# Altium schematic sheet 007.SchDoc
size A
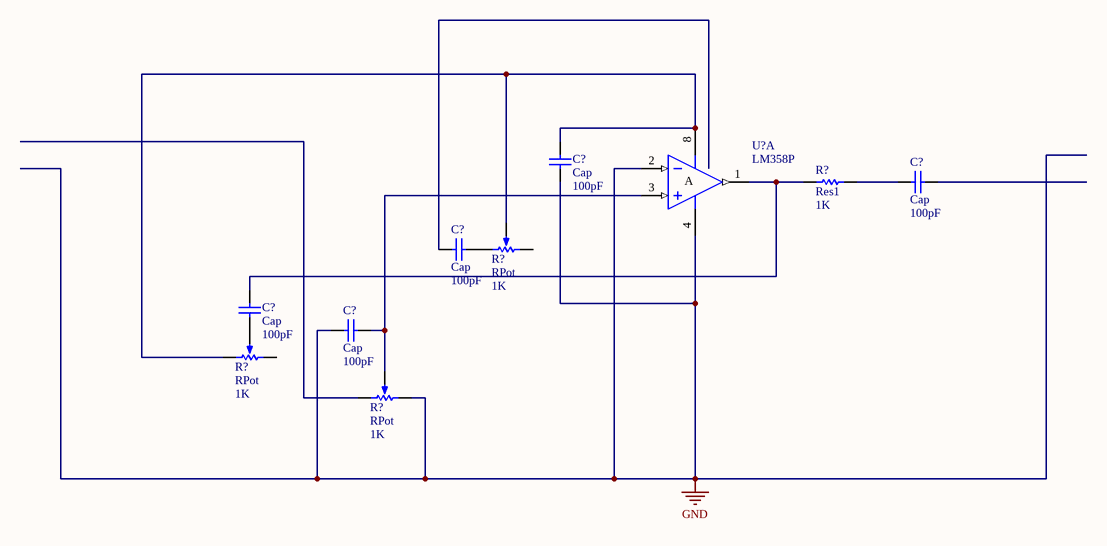
[diagram p0: 007.SchDoc]

## Parts
(Parts that share a designator on the sheet are numbered #1, #2 ... from top to bottom, then left to right.)
C?#1  Cap  value 100pF  [RAD-0.3]
C?#2  Cap  value 100pF  [RAD-0.3]
C?#3  Cap  value 100pF  [RAD-0.3]
C?#4  Cap  value 100pF  [RAD-0.3]
C?#5  Cap  value 100pF  [RAD-0.3]
R?#1  Res1  value 1K  [AXIAL-0.3]
R?#2  RPot  value 1K  [VR5]
R?#3  RPot  value 1K  [VR5]
R?#4  RPot  value 1K  [VR5]
U?  LM358P  [P008]  (part A of 2)

## Nets
GND: C?#1.1 C?#5.1 R?#4.1(TOP) U?.2(IN-) U?.4(V-)
NetC?#1_2: C?#1.2 R?#2.3(TAP) R?#3.2(BOT) U?.8(V+)
NetC?#2_1: C?#2.1 R?#1.2
NetC?#3_2: C?#3.2 R?#2.2(BOT)
NetC?#4_1: C?#4.1 R?#3.3(TAP)
NetC?#4_2: C?#4.2 R?#1.1 U?.1(OUT)
NetC?#5_2: C?#5.2 R?#4.3(TAP) U?.3(IN+)

Not connected (* = marked no-connect by the designer): C?#2 2; C?#3 1; R?#2 1(TOP); R?#3 1(TOP); R?#4 2(BOT)

## Notes on the sheet
- (in symbol LM358P, part A) A

## Library data of the parts
C?#1-C?#5 = Cap: Capacitor; Published: 8-Jun-2000; LatestRevisionDate: 17-Jul-2002; LatestRevisionNote: Re-released for DXP Platform.; PackageReference: RAD-0.3; Publisher: Altium Limited; PackageDescription: Radial Cap, Thru-Hole; 2 Leads; 0.3 in Pin Spacing
R?#1 = Res1: Resistor; Published: 8-Jun-2000; LatestRevisionDate: 17-Jul-2002; LatestRevisionNote: Re-released for DXP Platform.; PackageReference: AXIAL-0.3; Publisher: Altium Limited; PackageDescription: Axial Device, Thru-Hole; 2 Leads; 0.3 in Pin Spacing
R?#2-R?#4 = RPot: Potentiometer; Sim Note: Enter the Resistance value and the set point into parameter fields.; Set Position: 0.5; Published: 8-Jun-2000; LatestRevisionDate: 17-Jul-2002; LatestRevisionNote: Re-released for DXP Platform.; PackageReference: VR5; Publisher: Altium Limited; PackageDescription: Variable Resistor, Thru-Hole; 3 Leads
U? = LM358P: Dual Operational Amplifier; Published: 16-Jan-2001; LatestRevisionDate: 04-Mar-2005; LatestRevisionNote: Stylized 3D Model Added.; DatasheetVersion: Jul-1998; PackageVersion: Jun-1999; PackageReference: P008; Publisher: Altium Limited; PackageDescription: DIP; 8 Leads; Row Spacing 7.62 mm; Pitch 2.54 mm; Code_JEDEC: MO-001-AN; ComponentLink1Description: Manufacturer Link; ComponentLink1URL: http://www.ti.com/; ComponentLink2Description: Datasheet; ComponentLink2URL: http://www-s.ti.com/sc/ds/lm358.pdf